# EasyEDA Pro project opendeep.pba001.cnc.v01.eprj

# Schematic opendeep.pba001.cnc.v01
Board Name: Board1; Create Date: 2026-05-07; Page Name: P1; Project Name: opendeep.pba001.cnc.v01; Schematic Name: opendeep.pba001.cnc.v01; Update Date: 2026-05-31; Company: EasyEDA.com; Page Size: A4; Version: V1.0
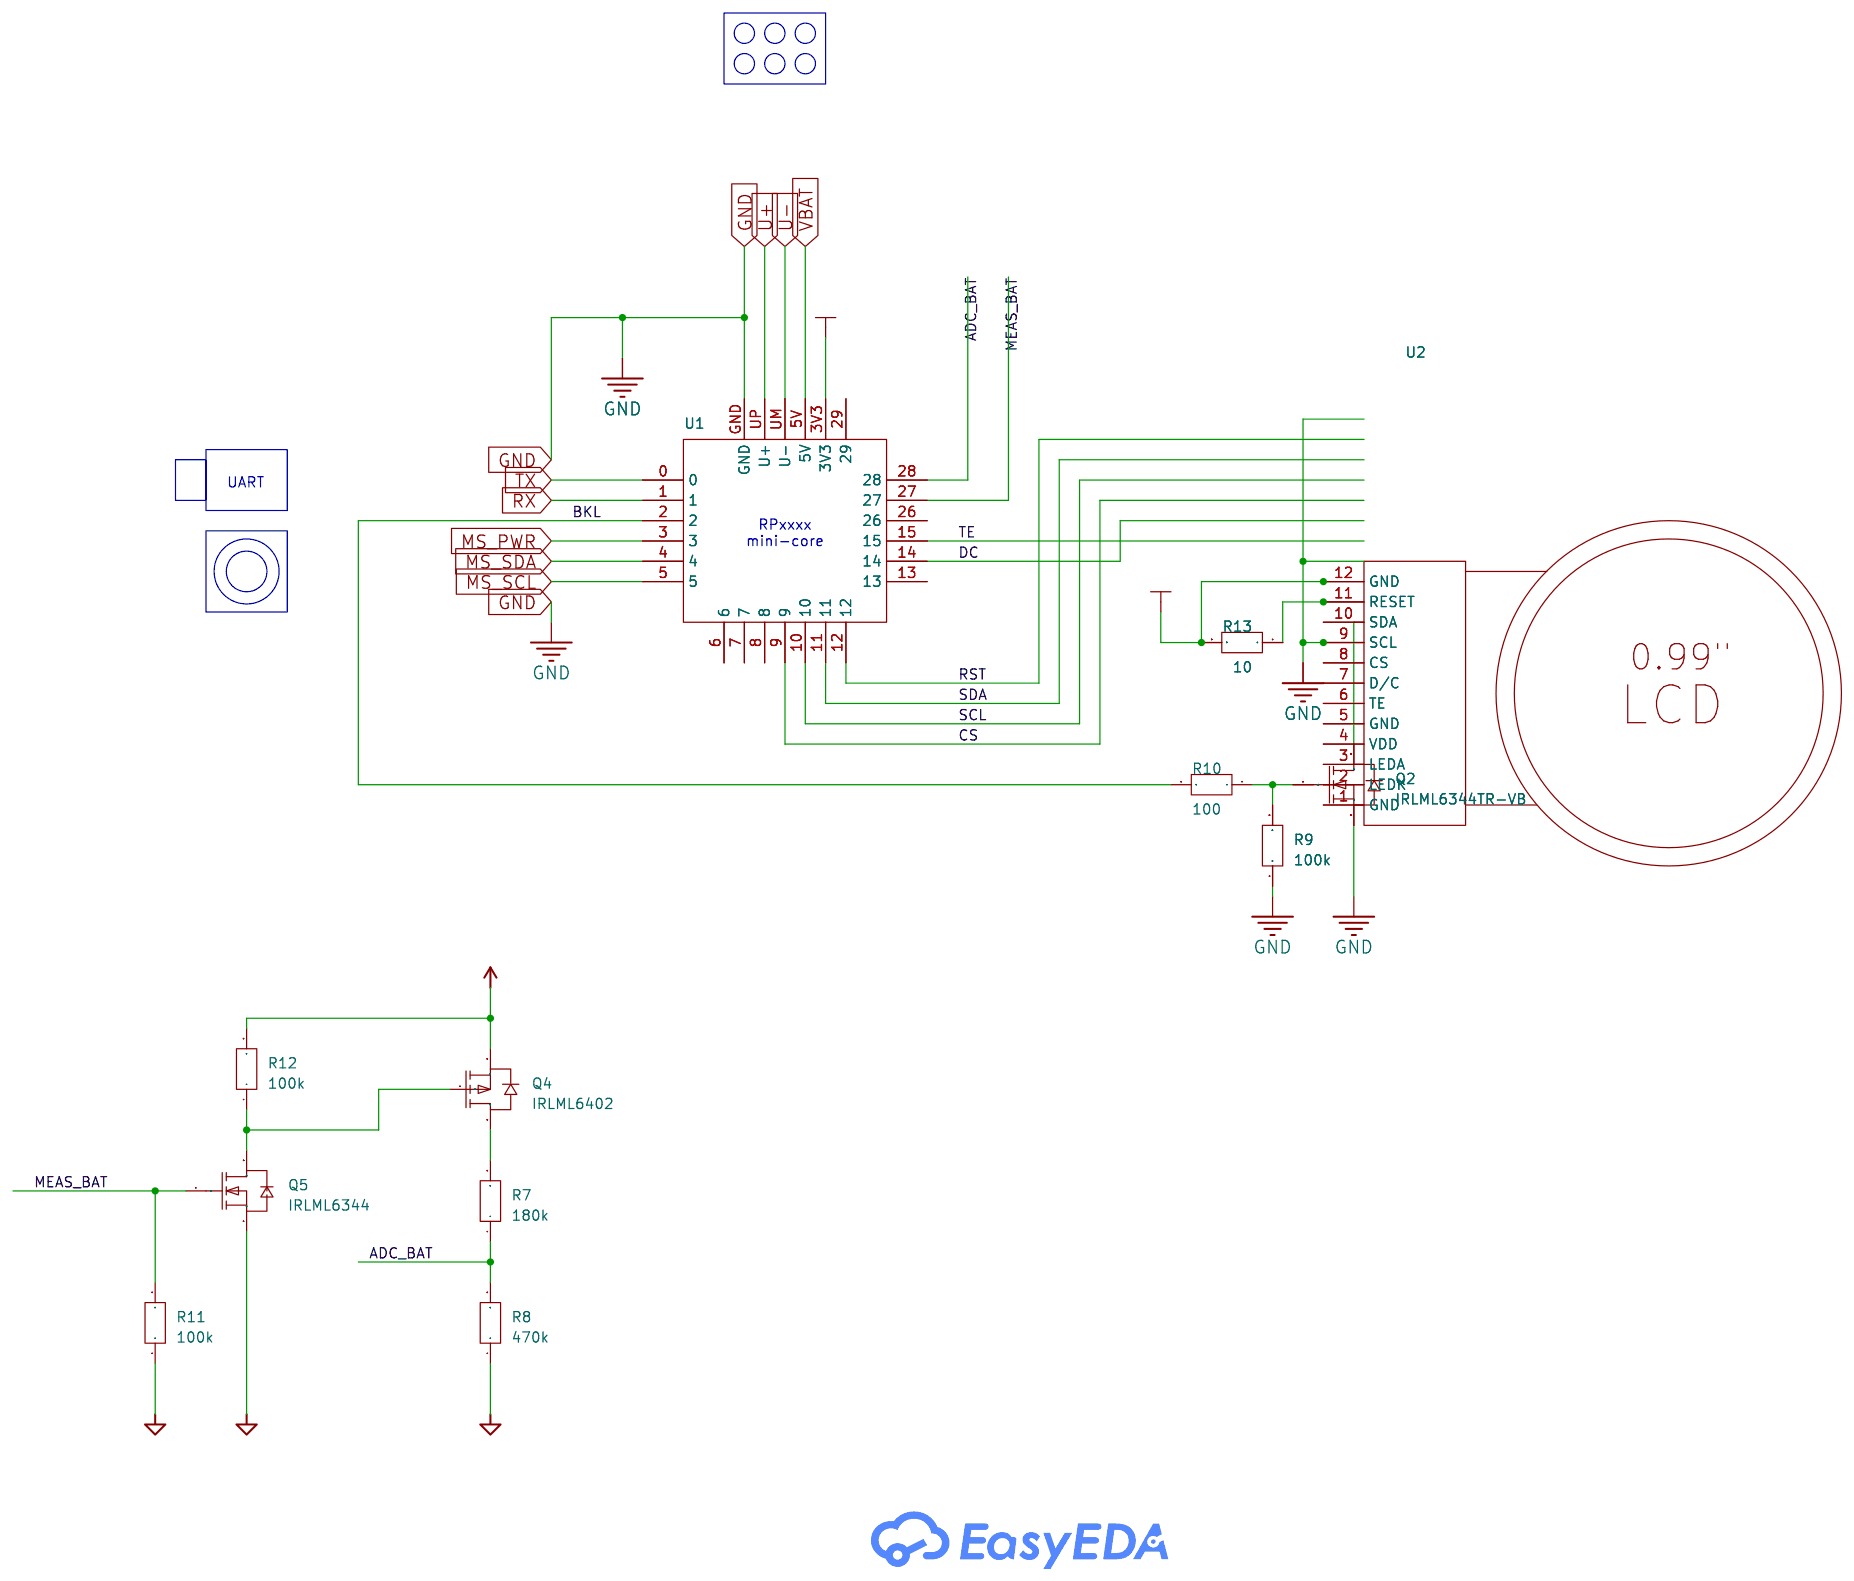
[diagram p0: schematic sheet]

## Parts
Q2  IRLML6344TR-VB  [SOT-23-3_L2.9-W1.3-P1.90-LS2.4-BR]
Q4  IRLML6402  [SOT-23-3_L2.9-W1.3-P1.90-LS2.4-BR]
Q5  IRLML6344  [SOT-23-3_L3.0-W1.7-P0.95-LS2.9-BR]
R7  180k  [R0603]
R8  470k  [R0603]
R9  100k  [R0603]
R10  100  [R0603]
R11  100k  [R0603]
R12  100k  [R0603]
R13  10  [R0603]
U1  -  [PR-mini-core]
U2  -  [LCD 0.99 bottom]

## Library data of the parts
Q2 = IRLML6344TR-VB: Type:1 N-channel Drain to Source Voltage:30V Current - Continuous Drain(Id):6.5A RDS(on):- Pd - Power Dissipation:1.1W Gate Threshold Voltage (Vgs(th)@Id):2V Gate Charge(Qg):4.5nC@10V Input Capacitance(Ciss@Vds):335pF@15V Reverse Transfer Capacitance (Crs; LCSC Part Name: 1个N沟道 耐压:30V 电流:6.5A; Supplier Part: C693370; Manufacturer: VBsemi(微碧半导体); Supplier Footprint: SOT-23; JLCPCB Part Class: Extended Part; Datasheet: https://atta.szlcsc.com/upload/public/pdf/source/20221101/67F54E55C74FC40D8CBA5BD6D3D7D1EA.pdf; Supplier: LCSC; Type: 1 N-channel; Drain to Source Voltage: 30V; Current - Continuous Drain(Id): 6.5A; Pd - Power Dissipation: 1.1W; Gate Threshold Voltage (Vgs(th)@Id): 2V; Gate Charge(Qg): 4.5nC@10V; Input Capacitance(Ciss@Vds): 335pF@15V; Operating Temperature: -55℃~+150℃
Q4 = IRLML6402: LCSC Part Name: P沟道 耐压:20V 电流:4.1A; Supplier Part: C2959853; Manufacturer: TECH PUBLIC(台舟); Supplier Footprint: SOT-23; JLCPCB Part Class: Extended Part; Datasheet: https://item.szlcsc.com/datasheet/IRLML6402/3346579.html; Supplier: LCSC; Drain to Source Voltage: 20V; Current - Continuous Drain(Id): 4.1A; RDS(on): 75mΩ@2.5V; Pd - Power Dissipation: 1.7W; Gate Threshold Voltage (Vgs(th)): 1V@250uA; Gate Charge(Qg): 7.8nC@4.5V; Input Capacitance(Ciss): 740pF@4V; Reverse Transfer Capacitance (Crss@Vds): 190pF@4V; Operating Temperature: -55℃~+150℃; Type: P-Channel
Q5 = IRLML6344: LCSC Part Name: 1个N沟道 耐压:30V 电流:5A; Supplier Part: C5364313; Manufacturer: Hottech(合科泰); Supplier Footprint: SOT-23; JLCPCB Part Class: Extended Part; Datasheet: https://item.szlcsc.com/datasheet/IRLML6344/6193391.html; Supplier: LCSC; Number: One N-channel; Drain to Source Voltage: 30V; Current - Continuous Drain(Id): 5A; RDS(on): 29mΩ@4.5V,5A; Pd - Power Dissipation: 1.3W; Gate Threshold Voltage (Vgs(th)): 1.1V; Gate Charge(Qg): 6.8nC@4.5V; Input Capacitance(Ciss): 650pF@25V; Reverse Transfer Capacitance (Crss@Vds): 46pF@15V; Operating Temperature: -55℃~+150℃
R7-R13 = RCC06031K50FKEA: Type:Thick Film Resistor Resistance:1.5kΩ Tolerance:±1% Tolerance:±1% Power(Watts):200mW Temperature Coefficient:±100ppm/℃ Temperature Coefficient:±100ppm/℃ Operating Temperature:-55℃~+155℃ Operating Temperature:-55℃~+155℃; LCSC Part Name: 厚膜电阻 1.5kΩ ±1% 200mW; Supplier Part: C4303195; Manufacturer: VISHAY(威世); Supplier Footprint: 0603; JLCPCB Part Class: Extended Part; Datasheet: https://item.szlcsc.com/datasheet/RCC06031K50FKEA/4873636.html; Supplier: LCSC; Type: Thick Film Resistor; Tolerance: ±1%; Power(Watts): 200mW; Temperature Coefficient: ±100ppm/℃; Operating Temperature: -55℃~+155℃
U1 = RP-mini-core
U2 = LCD 0.99

## Nets
3V3: R13.2 U1.3V3 U2.12(GND)
GND: Q2.2(S) Q5.2(S) R8.1 R9.1 R11.1 U1.GND U2.9(SCL)
VBAT: Q4.2(S) R12.2 U1.5V
ADC_BAT: R7.1 R8.2 U1.28
BKL: R10.2 U1.2
CS: U1.9
DC: U1.14
MEAS_BAT: Q5.1(G) R11.2 U1.27
MS_PWR: U1.3
MS_SCL: U1.5
MS_SDA: U1.4
RST: U1.12
RX: U1.1
SCL: U1.10
SDA: U1.11
TE: U1.15
TX: U1.0
U+: U1.UP(U+)
U-: U1.UM(U-)
$1N1457: Q2.1(G) R9.2 R10.1
$1N2069: Q4.1(G) Q5.3(D) R12.1
$1N5627: Q4.3(D) R7.2
Net-(R13-1): R13.1 U2.11(RESET)

Not connected (* = marked no-connect by the designer): Q2 3(D); U1 6 7 8 13 26 29; U2 1(GND) 2(LEDK) 3(LEDA) 4(VDD) 5(GND) 6(TE) 7(D/C) 8(CS) 10(SDA)

## Notes on the sheet
- UART
- RPxxxx
  mini-core

# Board opendeep.pba001.cnc.v01
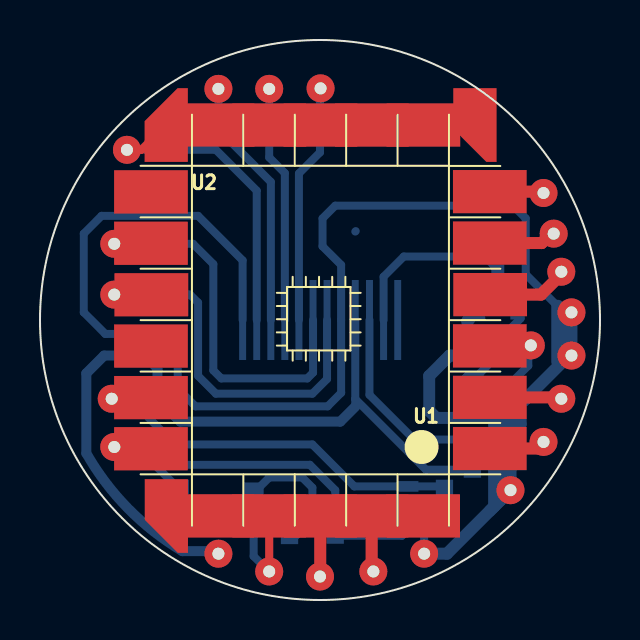
[diagram p1: board, top side]
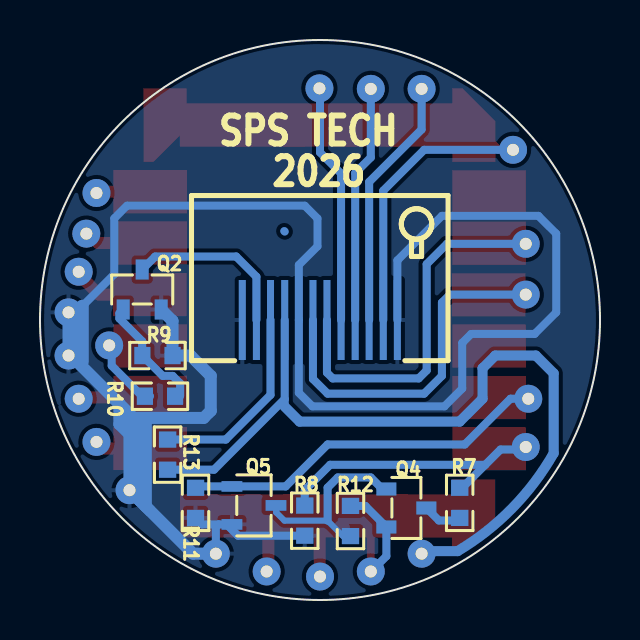
[diagram p2: board, bottom side, seen from below]

Outline 28 x 28 mm; copper layers: Top Layer, Bottom Layer. Coordinates in mm from the lower left corner of the outline.
Outline path: circle c14,14 r14
Stack: Top Layer 0.035mm / Dielectric1 1.51mm FR4 er 4.5 / Bottom Layer 0.035mm

## Design rules (mm)
template: JLCPCB Capability(Two Layers Board)
spacing copperThickness1oz (default): track to track 0.102, other pairs 0.152 to 0.3
spacing copperThickness2oz: track to track 0.203, other pairs 0.152 to 0.3
track width copperThickness1oz (default): min 0.127, default 0.254, max 2.54
track width copperThickness2oz: min 0.203, default 0.254, max 2.54
differential pair differentialPair (default): width min 0.127, default 0.254, max 2.54; gap min 0.152, default 0.152
via viaSize (default): diameter min 0.5, default 0.61, max 10; hole min 0.3, default 0.305, max 6.3

## Placement (name value [footprint] x y rotation side)
NOREF  -  [Pad_e149]  4.35 22.51 180 top
NOREF#2  -  [Pad_e244]  23.53 5.49 180 top
NOREF#3  -  [Pad_e86]  26.57 12.22 180 top
NOREF#4  -  [Pad_e11]  11.46 1.43 180 top
NOREF#5  -  [Pad_e142]  14.03 25.58 180 top
NOREF#6  -  [Pad_e185]  3.71 15.27 180 top
NOREF#7  -  [Pad_e15]  16.67 1.43 180 top
NOREF#8  -  [Pad_e418]  3.71 7.65 180 top
NOREF#9  -  [Pad_e274]  24.54 12.73 180 top
NOREF#10  -  [Pad_e242]  25.68 18.32 180 top
NOREF#11  -  [Pad_e147]  11.46 25.56 180 top
NOREF#12  -  [Pad_e6]  8.92 2.32 180 top
NOREF#13  -  [Pad_e241]  25.18 20.35 180 top
NOREF#14  -  [Pad_e14]  14 1.17 180 top
NOREF#15  -  [Pad_e49]  19.21 2.32 180 top
NOREF#16  -  [Pad_e88]  26.06 10.06 180 top
NOREF#17  -  [Pad_e87]  25.18 7.9 180 top
NOREF#18  -  [Pad_e236]  26.06 16.41 180 top
NOREF#19  -  [Pad_e148]  8.92 25.56 180 top
NOREF#20  -  [Pad_e417]  3.59 10.06 180 top
NOREF#21  -  [Pad_e324]  26.57 14.38 180 top
NOREF#22  -  [Pad_e184]  3.71 17.81 180 top
Q2  IRLML6344TR-VB  [SOT-23-3_L2.9-W1.3-P1.90-LS2.4-BR]  22.89 15.52 270 bottom
Q4  IRLML6402  [SOT-23-3_L2.9-W1.3-P1.90-LS2.4-BR]  9.68 4.6 0 bottom
Q5  IRLML6344  [SOT-23-3_L3.0-W1.7-P0.95-LS2.9-BR]  17.3 4.73 0 bottom
R7  180k  [R0603]  7.01 4.86 270 bottom
R8  470k  [R0603]  14.76 3.97 90 bottom
R9  100k  [R0603]  22.13 12.22 0 bottom
R10  100  [R0603]  22 10.19 0 bottom
R11  100k  [R0603]  20.22 4.86 90 bottom
R12  100k  [R0603]  12.48 3.95 90 bottom
R13  10  [R0603]  21.62 7.27 270 bottom
U1  -  [PR-mini-core]  23.02 3.71 180 top
U2  -  [LCD 0.99 bottom]  14 16.16 0 top

## Footprints (pads in the part's own frame, mm; a bottom-side part is the same pattern mirrored in y, then rotated)
LCD 0.99 bottom
  rect 0.35x4 smd far side: 1(3.885,-2.159) 2(3.179,-2.159) 3(2.474,-2.159) 4(1.764,-2.159) 5(1.058,-2.159) 6(0.352,-2.159) 7(-0.347,-2.159) 8(-1.054,-2.159) 9(-1.759,-2.159) 10(-2.458,-2.159) 11(-3.164,-2.159) 12(-3.869,-2.159)
Pad_e6
  round 1.4 hole 0.6: 1(0,0)
Pad_e11
  round 1.4 hole 0.6: 1(0,0)
Pad_e14
  round 1.4 hole 0.6: 2(0,0)
Pad_e15
  round 1.4 hole 0.6: 1(0,0)
Pad_e49
  round 1.4 hole 0.6: 1(0,0)
Pad_e86
  round 1.4 hole 0.6: 1(0,0)
Pad_e87
  round 1.4 hole 0.6: 1(0,0)
Pad_e88
  round 1.4 hole 0.6: 1(0,0)
Pad_e142
  round 1.4 hole 0.6: 1(0,0)
Pad_e147
  round 1.4 hole 0.6: 1(0,0)
Pad_e148
  round 1.4 hole 0.6: 1(0,0)
Pad_e149
  round 1.4 hole 0.6: 1(0,0)
Pad_e184
  round 1.4 hole 0.6: 1(0,0)
Pad_e185
  round 1.4 hole 0.6: 1(0,0)
Pad_e236
  round 1.4 hole 0.6: 1(0,0)
Pad_e241
  round 1.4 hole 0.6: 1(0,0)
Pad_e242
  round 1.4 hole 0.6: 1(0,0)
Pad_e244
  round 1.4 hole 0.6: 1(0,0)
Pad_e274
  round 1.4 hole 0.6: 1(0,0)
Pad_e324
  round 1.4 hole 0.6: 1(0,0)
Pad_e417
  round 1.4 hole 0.6: 1(0,0)
Pad_e418
  round 1.4 hole 0.6: 1(0,0)
PR-mini-core
  custom 3.683x2.159 smd: 0(0.528,-3.86) 1(0.528,-6.418) 2(0.528,-8.995) 3(0.508,-11.557) 3V3(14.144,-0.492) 4(0.528,-14.134) 5(0.528,-16.704) 5V(11.566,-0.492) 7(3.85,-20.036) 8(6.425,-20.036) 9(8.995,-20.036) 10(11.557,-20.036) 11(14.135,-20.036) 13(17.469,-16.695) 14(17.469,-14.124) 15(17.449,-11.547) 26(17.469,-8.985) 27(17.469,-6.408) 28(17.469,-3.85) GND(3.859,-0.492) UM(9.004,-0.492) UP(6.434,-0.492)
  custom 2.159x3.683 smd: 6(1.27,-20.036) 6(16.701,-0.484) 12(16.707,-20.036)
R0603
  rect 0.806x0.864 smd: 1(-0.753,0) 2(0.753,0)
SOT-23-3_L2.9-W1.3-P1.90-LS2.4-BR
  rect 1x0.65 smd: 1(1,-0.95) 2(1,0.95) 3(-1,0)
SOT-23-3_L3.0-W1.7-P0.95-LS2.9-BR
  rect 1.038x0.532 smd: 1(1.101,-0.95) 2(1.101,0.95) 3(-1.101,0)

## Nets
3V3: NOREF#12.1 R13.2 U1.3V3 U2.4
GND: NOREF#2.1 NOREF#3.1 NOREF#15.1 NOREF#21.1 Q2.2 Q5.2 R8.1 R9.1 R11.1 U1.GND U2.1 U2.5 U2.12
VBAT: NOREF#4.1 Q4.2 R12.2 U1.5V
ADC_BAT: NOREF#8.1 R7.1 R8.2 U1.28
BKL: NOREF#9.1 R10.2 U1.2
CS: NOREF#5.1 U1.9 U2.8
DC: NOREF#22.1 U1.14 U2.7
MEAS_BAT: NOREF#20.1 Q5.1 R11.2 U1.27
MS_PWR: NOREF#18.1 U1.3
MS_SCL: NOREF#13.1 U1.5
MS_SDA: NOREF#10.1 U1.4
RST: NOREF.1 U1.12 U2.11
RX: NOREF#16.1 U1.1
SCL: NOREF#11.1 U1.10 U2.9
SDA: NOREF#19.1 U1.11 U2.10
TE: NOREF#6.1 U1.15 U2.6
TX: NOREF#17.1 U1.0
U+: NOREF#7.1 U1.UP
U-: NOREF#14.2 U1.UM
$1N1452: Q2.3 U2.2
$1N1457: Q2.1 R9.2 R10.1
$1N2069: Q4.1 Q5.3 R12.1
$1N4249: R13.1 U2.3
$1N5627: Q4.3 R7.2

Pads without a net: U1 6 7 8 13 26

## Routing (per net, layer and track width the routed paths; a pad name or vN(x,y) marks a point on that pad's centre or on a via; arc(x,y) is an arc through that point)
3V3: length 40.8
  Bottom Layer w0.4: 15.76,10.05 19.3,6.52 R13.2 ; 15.76,10.05 15.76,9.67 ; 15.76,10.05 U2.4 ; 15.76,18.42 15.79,18.44
  Bottom Layer w0.5: 15.76,9.67 15.02,8.92 7.01,8.92 5.87,10.06 5.87,11.59 5.24,12.22 3.21,12.22 2.32,11.33 2.32,7.34 arc(4.4,4.58) 7.12,2.44 8.92,2.44
GND: length 94.3
  Bottom Layer w0.4: R8.1 18.1,3.21 18.66,3.78 19.08,3.78 ; NOREF#15.1 19.21,3.65 19.08,3.78 ; R11.1 19.9,3.78 19.08,3.78 ; 25.89,14.69 24.29,16.29 24.29,19.08 23.65,19.72 14.76,19.72 14.13,19.08 14.13,17.68 15.06,16.75 U2.5 15.06,10.36 14.38,9.68 7.78,9.68 6.89,10.57 6.89,12.86 6.44,13.3 3.27,13.3 2.19,14.38 2.19,18.32 3.08,19.21 7.9,19.21 10.13,16.98 U2.12
  Bottom Layer w0.6: Q2.2 21.37,13.96 R9.1 20.48,12.22 19.46,11.21 19.46,9.46 19.82,9.1 22.71,9.1 23.53,8.28 ; NOREF#15.1 20.35,2.32 NOREF#2.1 23.53,8.28 ; 23.53,8.28 24.03,8.79 24.03,9.81 26.04,11.82 ; NOREF#21.1 NOREF#3.1 26.19,12.22
  Bottom Layer w0.65: 25.89,14.69 25.89,11.92
VBAT: length 7.6
  Top Layer w0.4: U1.5V 11.46,4.2 NOREF#4.1
  Bottom Layer w0.4: NOREF#4.1 11.44,1.43 10.68,2.19 Q4.2 11.73,4.7 R12.2
ADC_BAT: length 14.6
  Bottom Layer w0.4: 7.01,5.48 5.74,6.76 ; 5.74,6.76 13.49,6.76 14.76,5.49 R8.2 ; 5.74,6.76 4.97,7.52 3.71,7.52 3.59,7.65
BKL: length 3.2
  Bottom Layer w0.4: 22.5,10.19 22.89,10.19 24.41,11.71 24.41,12.35
CS: length 12
  Bottom Layer w0.4: U2.8 12.95,21.33 14,22.38 14,25.55 NOREF#5.1
DC: length 18.6
  Bottom Layer w0.4: NOREF#22.1 7.65,17.81 8.67,16.79 8.67,11.48 9.07,11.08 13.37,11.08 13.65,11.37 U2.7
MEAS_BAT: length 18.5
  Bottom Layer w0.4: R11.2 20.15,5.68 Q5.1 15.72,5.68 13.62,7.78 6.76,7.78 4.47,10.06 NOREF#20.1
MS_PWR: length 4
  Top Layer w0.6: 26.06,16.29 25.05,15.27 U1.3
MS_SCL: length 2.7
  Top Layer w0.6: U1.5 25.11,20.42 NOREF#13.1
MS_SDA: length 3.3
  Top Layer w0.6: U1.4 25.09,17.85 25.56,18.32
RST: length 16.3
  Top Layer w0.4: NOREF.1 5.07,22.51 U1.12
  Bottom Layer w0.4: U2.11 10.84,20.47 8.79,22.51 NOREF.1
RX: length 3.6
  Top Layer w0.6: U1.1 26,10.13 NOREF#16.1
SCL: length 11.9
  Bottom Layer w0.4: NOREF#11.1 11.46,22.13 12.24,21.35 U2.9
SDA: length 12.6
  Bottom Layer w0.4: U2.10 11.54,20.9 8.92,23.53 NOREF#19.1
TE: length 18.1
  Bottom Layer w0.4: U2.6 14.35,11.05 13.62,10.32 8.79,10.32 7.9,11.21 7.9,14.87 7.5,15.27 NOREF#6.1
TX: length 2.7
  Top Layer w0.6: 25.18,7.65 25.1,7.57 U1.0
U+: length 2.8
  Top Layer w0.6: U1.UP 16.58,1.51 NOREF#7.1
U-: length 2.8
  Top Layer w0.6: U1.UM 14.01,1.44 14,1.43
$1N1452: length 8.6
  Bottom Layer w0.4: Q2.3 22.24,17.17 18.19,17.17 17.18,16.16 U2.2
$1N1457: length 5.8
  Bottom Layer w0.4: 22.89,12.42 22.89,12.94 24.03,14.08 24.03,14.33 Q2.1 ; R9.2 21.87,11.21 21.37,11.21 20.99,10.83 20.99,10.19
$1N2069: length 9.6
  Bottom Layer w0.3: R12.1 12.85,3.2 13.62,3.97 15.78,3.97 16.19,4.38 16.19,4.73
  Bottom Layer w0.4: Q4.1 10.89,5.55 11.46,6.13 13.11,6.13 13.62,5.62 13.62,3.97
$1N4249: length 9.8
  Bottom Layer w0.4: R13.1 18.71,8.02 16.47,10.26 U2.3
$1N5627: length 1.9
  Bottom Layer w0.4: 7.01,3.98 8.06,3.98 Q4.3

## Copper pours and planes (outline as drawn; the poured copper is in the pictures)
GND on Bottom Layer: -0.35,28.35 28.22,28.35 28.22,-0.22 -0.35,-0.22

## Text on the board
Bottom Silkscreen Layer: 2026 | SPS TECH
